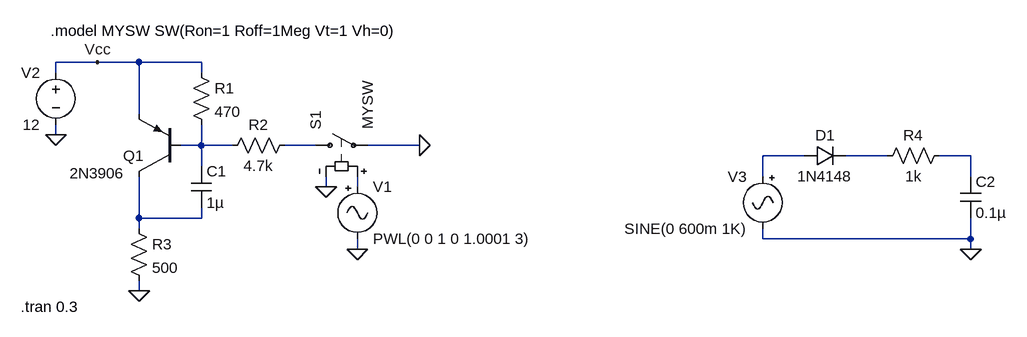
[diagram p0: schematic trigger.asc]
trigger.asc, the LTspice schematic file:
Version 4
SHEET 1 1436 680
WIRE 32 16 -32 16
WIRE 96 16 32 16
WIRE 192 16 96 16
WIRE -32 32 -32 16
WIRE 192 32 192 16
WIRE 96 96 96 16
WIRE -32 128 -32 112
WIRE 192 144 192 112
WIRE 192 144 160 144
WIRE 240 144 192 144
WIRE 368 144 320 144
WIRE 528 144 448 144
WIRE 1120 160 1056 160
WIRE 1248 160 1184 160
WIRE 1376 160 1328 160
WIRE 192 176 192 144
WIRE 1056 192 1056 160
WIRE 1376 192 1376 160
WIRE 384 208 384 192
WIRE 432 208 432 192
WIRE 96 256 96 192
WIRE 192 256 192 240
WIRE 192 256 96 256
WIRE 96 272 96 256
WIRE 1056 288 1056 272
WIRE 1376 288 1376 256
WIRE 1376 288 1056 288
WIRE 432 304 432 288
WIRE 1376 304 1376 288
WIRE 96 368 96 352
FLAG -32 128 0
FLAG 432 304 0
FLAG 96 368 0
FLAG 384 208 0
FLAG 32 16 Vcc
FLAG 528 144 0
FLAG 1376 304 0
SYMBOL pnp 160 192 R180
WINDOW 3 86 5 Left 2
SYMATTR InstName Q1
SYMATTR Value 2N3906
SYMBOL cap 176 176 R0
SYMATTR InstName C1
SYMATTR Value 1µ
SYMBOL res 176 16 R0
SYMATTR InstName R1
SYMATTR Value 470
SYMBOL res 336 128 R90
WINDOW 0 0 56 VBottom 2
WINDOW 3 32 56 VTop 2
SYMATTR InstName R2
SYMATTR Value 4.7k
SYMBOL Misc\\signal 432 192 R0
WINDOW 123 0 0 Left 0
WINDOW 39 0 0 Left 0
SYMATTR InstName V1
SYMATTR Value PWL(0 0 1 0 1.0001 3)
SYMBOL voltage -32 16 M0
WINDOW 123 0 0 Left 0
WINDOW 39 0 0 Left 0
SYMATTR InstName V2
SYMATTR Value 12
SYMBOL res 80 256 R0
SYMATTR InstName R3
SYMATTR Value 500
SYMBOL sw 352 144 R270
SYMATTR InstName S1
SYMATTR Value MYSW
SYMBOL Misc\\signal 1056 176 M0
WINDOW 123 0 0 Left 0
WINDOW 39 0 0 Left 0
SYMATTR InstName V3
SYMATTR Value SINE(0 600m 1K)
SYMBOL res 1344 144 R90
WINDOW 0 0 56 VBottom 2
WINDOW 3 32 56 VTop 2
SYMATTR InstName R4
SYMATTR Value 1k
SYMBOL cap 1360 192 R0
SYMATTR InstName C2
SYMATTR Value 0.1µ
SYMBOL diode 1120 176 R270
WINDOW 0 32 32 VTop 2
WINDOW 3 0 32 VBottom 2
SYMATTR InstName D1
SYMATTR Value 1N4148
TEXT -40 -32 Left 2 !.model MYSW SW(Ron=1 Roff=1Meg Vt=1 Vh=0)
TEXT -86 392 Left 2 !.tran 0.3

The netlist it stands for:
* trigger.asc
Q1 N007 N001 Vcc 0 2N3906
C1 N001 N007 1µ
R1 Vcc N001 470
R2 N002 N001 4.7k
V1 N006 0 PWL(0 0 1 0 1.0001 3)
V2 Vcc 0 12
R3 N007 0 500
S1 N002 0 N006 0 MYSW
V3 N003 0 SINE(0 600m 1K)
R4 N005 N004 1k
C2 N005 0 0.1µ
D1 N003 N004 1N4148
.model D D
.lib standard.dio
.model NPN NPN
.model PNP PNP
.lib standard.bjt
.model MYSW SW(Ron=1 Roff=1Meg Vt=1 Vh=0)
.tran 0.3
.backanno
.end